# EAGLE design spoke-indus2 (EAGLE 5.10)
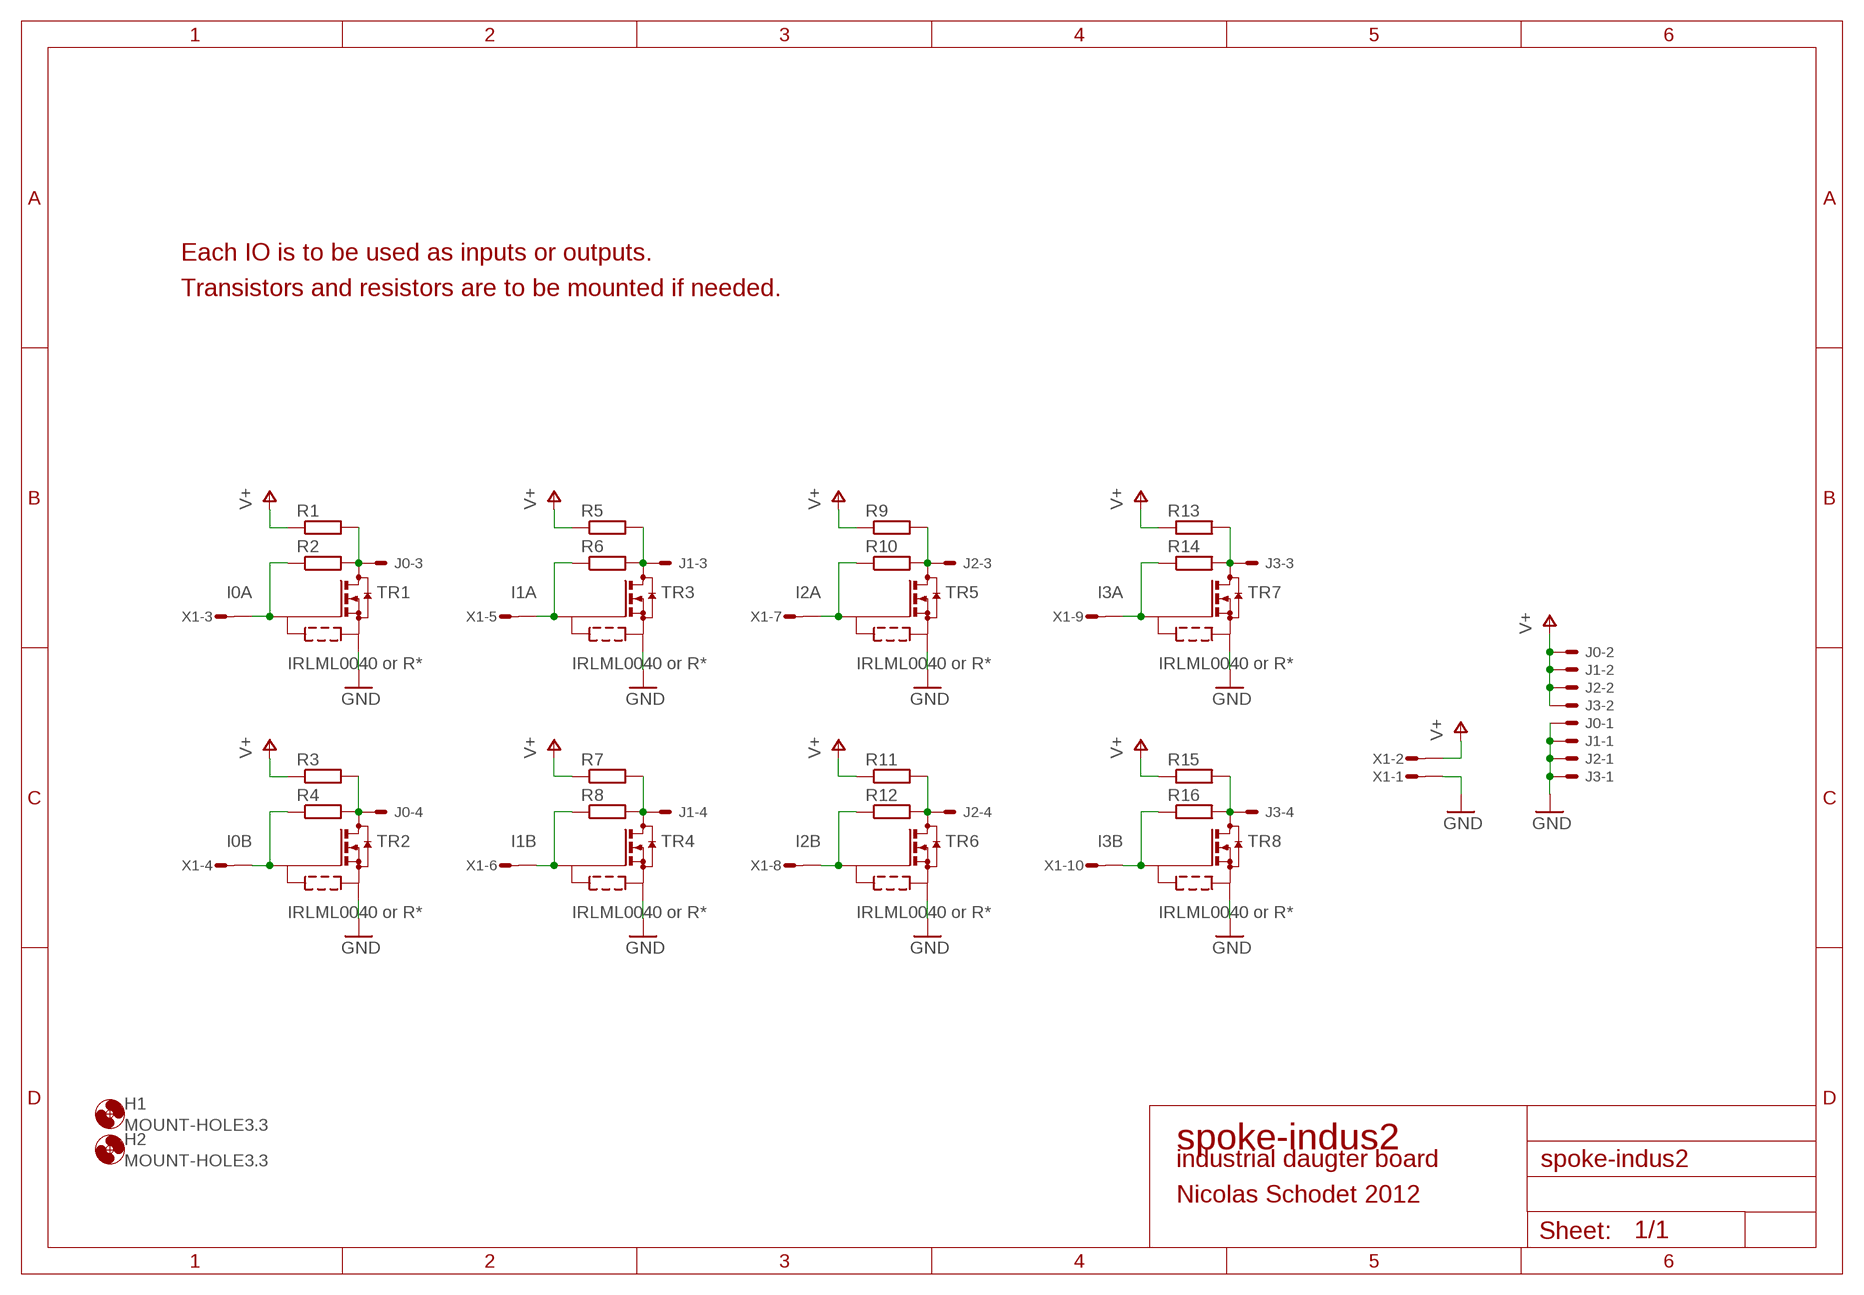
[diagram p0: schematic, sheet 1]

## Parts
H1  MOUNT-HOLE3.3  [3,3]
H2  MOUNT-HOLE3.3  [3,3]
J0  ED1X04  [ED1X04]
J1  ED1X04  [ED1X04]
J2  ED1X04  [ED1X04]
J3  ED1X04  [ED1X04]
R1  R-EU_R0603  [R0603]
R2  R-EU_R0603  [R0603]
R3  R-EU_R0603  [R0603]
R4  R-EU_R0603  [R0603]
R5  R-EU_R0603  [R0603]
R6  R-EU_R0603  [R0603]
R7  R-EU_R0603  [R0603]
R8  R-EU_R0603  [R0603]
R9  R-EU_R0603  [R0603]
R10  R-EU_R0603  [R0603]
R11  R-EU_R0603  [R0603]
R12  R-EU_R0603  [R0603]
R13  R-EU_R0603  [R0603]
R14  R-EU_R0603  [R0603]
R15  R-EU_R0603  [R0603]
R16  R-EU_R0603  [R0603]
TR1  IRLML0040 or R*  N-MOS_R  [SOT23_R0603]
TR2  IRLML0040 or R*  N-MOS_R  [SOT23_R0603]
TR3  IRLML0040 or R*  N-MOS_R  [SOT23_R0603]
TR4  IRLML0040 or R*  N-MOS_R  [SOT23_R0603]
TR5  IRLML0040 or R*  N-MOS_R  [SOT23_R0603]
TR6  IRLML0040 or R*  N-MOS_R  [SOT23_R0603]
TR7  IRLML0040 or R*  N-MOS_R  [SOT23_R0603]
TR8  IRLML0040 or R*  N-MOS_R  [SOT23_R0603]
X1  MICROMATCH-10  [MICROMATCH-10]

## Nets
GND [supply]: J0.1 J1.1 J2.1 J3.1 TR1.2(S) TR2.2(S) TR3.2(S) TR4.2(S) TR5.2(S) TR6.2(S) TR7.2(S) TR8.2(S) X1.1
I0A: R2.1 TR1.1(G) X1.3
I0AJ: J0.3 R1.2 R2.2 TR1.3(D)
I0B: R4.1 TR2.1(G) X1.4
I0BJ: J0.4 R3.2 R4.2 TR2.3(D)
I1A: R6.1 TR3.1(G) X1.5
I1AJ: J1.3 R5.2 R6.2 TR3.3(D)
I1B: R8.1 TR4.1(G) X1.6
I1BJ: J1.4 R7.2 R8.2 TR4.3(D)
I2A: R10.1 TR5.1(G) X1.7
I2AJ: J2.3 R9.2 R10.2 TR5.3(D)
I2B: R12.1 TR6.1(G) X1.8
I2BJ: J2.4 R11.2 R12.2 TR6.3(D)
I3A: R14.1 TR7.1(G) X1.9
I3AJ: J3.3 R13.2 R14.2 TR7.3(D)
I3B: R16.1 TR8.1(G) X1.10
I3BJ: J3.4 R15.2 R16.2 TR8.3(D)
V+: J0.2 J1.2 J2.2 J3.2 R1.1 R3.1 R5.1 R7.1 R9.1 R11.1 R13.1 R15.1 X1.2

## Notes on the sheet
- Each IO is to be used as inputs or outputs.
- Transistors and resistors are to be mounted if needed.
- spoke-indus2
- industrial daugter board
- Nicolas Schodet 2012

## Library data of the parts
H1 H2 = holes:MOUNT-HOLE: MOUNTING HOLE with drill center marker
J0 J1-J3 = apbteam_con-amp-he14:E?1X04: Male header simple row, 4 positions
R1-R16 = apbteam_rcl:R-EU_: RESISTOR, European symbol
TR1-TR8 = apbteam_transistor-small-signal:N-MOS_R: N-CHANNEL MOS FET or Resistor Only one can be mounted.
X1 = apbteam_con-amp-micromatch:MICROMATCH-10: MicroMaTch 10

## Net classes
1 supply: width 0.254 mm

## Board
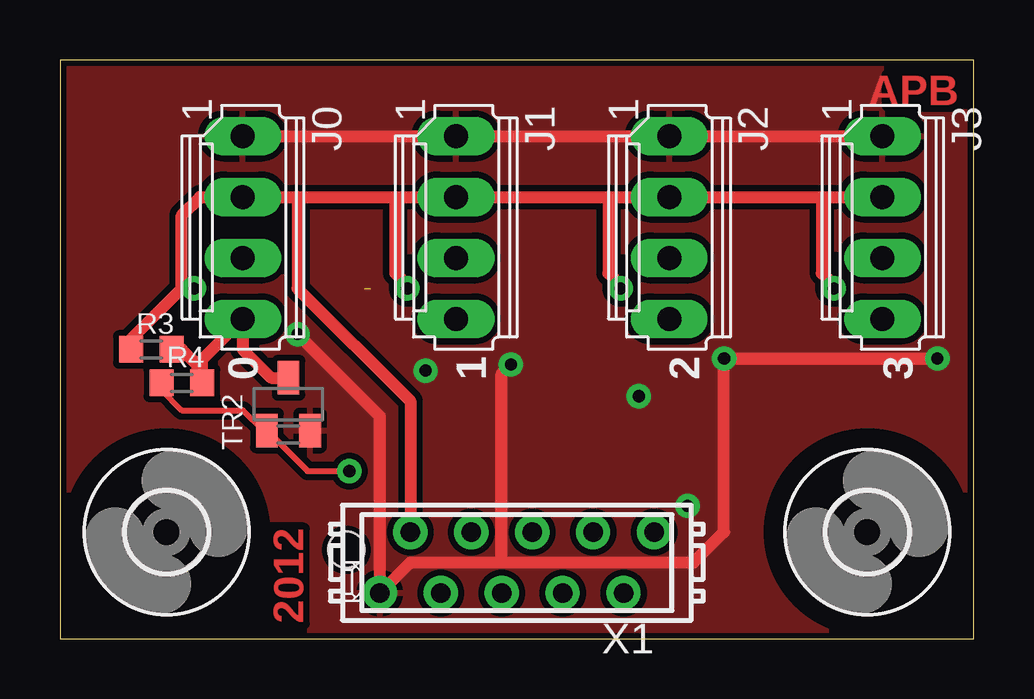
[diagram p1: board, top side]
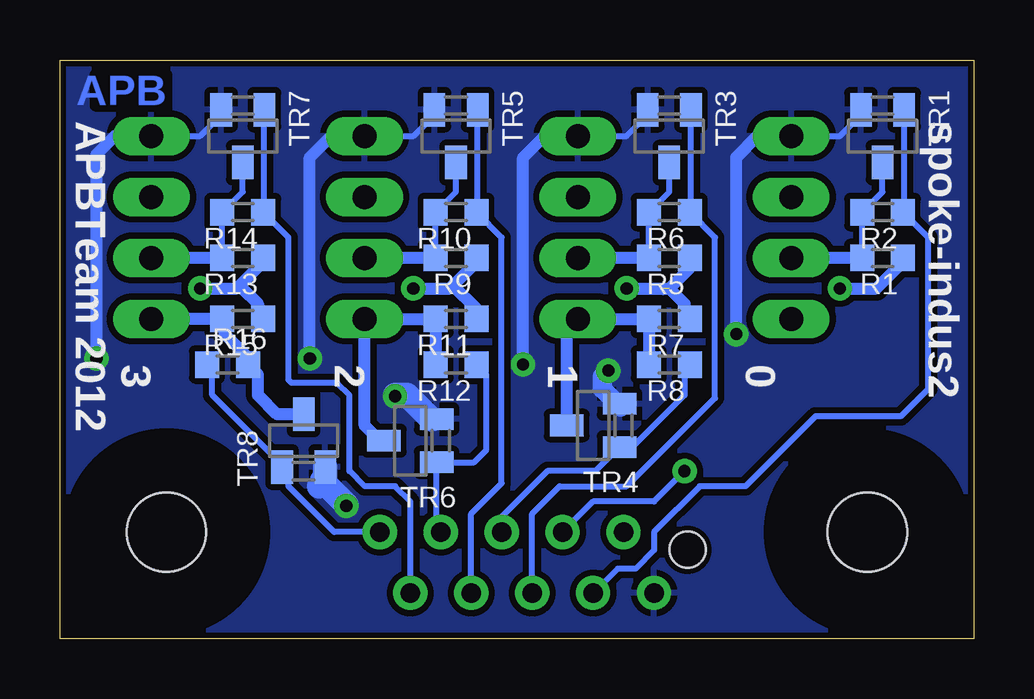
[diagram p2: board, bottom side, seen from below]

Size 38.1 x 24.13 mm. Coordinates in mm from the lower left corner, seen from the top.
Outline: 0,0 38.1,0 38.1,24.13 0,24.13 0,0
Copper layers (1*16): Top 0.035mm / dielectric 1.5mm / Bottom 0.035mm
Design rules "SparkFun": minimum track width 8mil, minimum drill 20mil, track to track 8mil, track to pad 8mil, pad to pad 8mil, via to via 8mil, smd to smd 8mil, copper to edge 10mil, drill to drill 8mil, minimum pad ring 12mil, minimum via ring 10mil, stop-mask expansion 4mil, vias tented up to drill 25mil, thermal gap 10mil

### Footprints (pad centres in the part's own frame; a part is rotated, then mirrored left to right if it is on the bottom)
3,3 = hole 3.3: 0,0
ED1X04 = drill 1 long: 1 -3.81,0; 2 -1.27,0; 3 1.27,0; 4 3.81,0
R0603 = smd 1 x 1.1: 1 -0.85,0; 2 0.85,0
SOT23_R0603 = smd 0.9 x 1.4: 1 -0.9,-1.1; 2 0.9,-1.1; 3 0,1.1
MICROMATCH-10 = drill 0.813 round: 1 5.715,1.27; 2 4.445,-1.27; 3 3.175,1.27; 4 1.905,-1.27; 5 0.635,1.27; 6 -0.635,-1.27; 7 -1.905,1.27; 8 -3.175,-1.27; 9 -4.445,1.27; 10 -5.715,-1.27 | hole 1.5: 7.11,-0.53

### Placement (x,y rotation side)
H1  4.45,4.45 0 top
H2  33.66,4.45 0 top
J0  7.62,17.14 270 top
J1  16.51,17.14 270 top
J2  25.4,17.14 270 top
J3  34.29,17.14 270 top
R1  3.81,15.88 180 bottom
R2  3.81,17.78 180 bottom
R3  3.81,12.06 0 top
R4  5.08,10.67 0 top
R5  12.7,15.88 180 bottom
R6  12.7,17.78 180 bottom
R7  12.7,13.34 180 bottom
R8  12.7,11.43 180 bottom
R9  21.59,15.88 180 bottom
R10  21.59,17.78 180 bottom
R11  21.59,13.34 180 bottom
R12  21.59,11.43 180 bottom
R13  30.48,15.88 180 bottom
R14  30.48,17.78 180 bottom
R15  30.48,13.34 180 bottom
R16  31.11,11.43 0 bottom
TR1  3.81,20.95 180 bottom
TR2  9.53,9.78 0 top
TR3  12.7,20.95 180 bottom
TR4  15.88,8.89 90 bottom
TR5  21.59,20.95 180 bottom
TR6  23.5,8.26 90 bottom
TR7  30.48,20.95 180 bottom
TR8  27.94,8.26 0 bottom
X1  19.05,3.17 180 top

### Tracks (layer width: path | path; a pad name or v marks a point on that pad's centre or on a via)
GND  (via drill 0.51)
  Top 0.508: J0.1 J1.1 J2.1 J3.1 | v9.91,12.7 13.34,9.27 X1.1 14.61,3.17 18.41,3.17 | 18.41,3.17 18.41,11.05 v18.8,11.43 | 18.41,3.17 26.42,3.17 27.69,4.45 v27.69,11.68 v36.58,11.68
  Bottom 0.254: TR1.2 4.71,21.83 5.59,20.95 J0.1 | TR3.2 13.6,21.83 14.48,20.95 J1.1 | TR5.2 22.49,21.83 23.37,20.95 J2.1 | TR7.2 31.38,21.83 32.26,20.95 J3.1
  Bottom 0.508: J0.1 9.02,20.95 9.91,20.07 v9.91,12.7 | v18.8,11.43 18.8,20.07 17.91,20.95 J1.1 | v27.69,11.68 27.69,20.07 26.8,20.95 J2.1 | v36.58,11.68 36.58,20.19 35.81,20.95 J3.1
  Bottom 0.813: v15.24,11.18 15.49,10.92 15.49,10.41 14.73,9.65
  Bottom 1.016: 24.13,10.16 23.62,10.16 22.61,9.14 | 27.18,6.6 26.16,5.59 | TR8.2 27.04,6.62 27.3,6.35
  other vias: 24.13,10.11 26.16,5.54
  pour Top (isolate 0.254): 0,24.13 38.1,24.13 38.1,0 0,0
  pour Bottom (isolate 0.254): 0,24.13 38.1,24.13 38.1,0 0,0
I0A
  Bottom 0.254: TR1.1 2.91,17.83 R2.1 1.91,16.73 1.91,10.41 3.05,9.27 6.6,9.27 9.53,6.35 11.43,6.35 13.34,4.45 13.34,3.68 14.1,2.92 14.86,2.92 X1.3
I0AJ
  Bottom 0.254: TR1.3 3.81,18.63 R2.2 R1.2
  Bottom 0.508: R1.2 J0.3
I0B  (via drill 0.51)
  Top 0.254: v12.06,6.99 10.32,6.99 TR2.1 8.47,8.68 7.62,9.53 5.08,9.53 4.23,10.38 R4.1
  Bottom 0.254: X1.4 15.88,5.71 13.34,5.71 v12.06,6.99
I0BJ
  Top 0.508: TR2.3 8.81,10.88 7.62,12.06 J0.4 5.93,11.64 R4.2 5.71,10.88 5.71,11.43 5.08,12.06 R3.2
I1A
  Bottom 0.254: TR3.1 11.8,17.83 R6.1 10.79,16.73 10.79,10.03 14.48,6.35 17.27,6.35 18.41,5.21 X1.5
I1AJ
  Bottom 0.254: TR3.3 12.7,18.63 R6.2 R5.2
  Bottom 0.508: R5.2 J1.3
I1B
  Bottom 0.254: R8.1 12.06,11.21 12.06,10.16 14.23,7.99 TR4.1 15.78,6.99 17.78,6.99 19.68,5.08 X1.6
I1BJ
  Bottom 0.508: TR4.3 16.98,12.87 J1.4 R7.2 R8.2
I2A
  Bottom 0.254: TR5.1 20.69,17.83 R10.1 19.68,16.73 19.68,6.48 20.95,5.21 X1.7
I2AJ
  Bottom 0.254: TR5.3 21.59,18.63 R10.2 R9.2
  Bottom 0.508: R9.2 J2.3
I2B
  Bottom 0.254: 20.95,11.21 R12.1 20.32,11.01 20.32,7.87 20.84,7.36 TR6.1 22.39,4.62 X1.8
I2BJ
  Bottom 0.508: R12.2 R11.2 J2.4 25.4,8.89 24.77,8.26 TR6.3
I3A
  Bottom 0.254: TR7.1 29.58,17.83 R14.1 28.57,16.73 28.57,10.79 28.45,10.67 26.54,10.67 26.04,10.16 26.04,6.99 25.4,6.35 24.13,6.35 23.5,5.71 X1.9
I3AJ
  Bottom 0.254: TR7.3 30.48,18.63 R14.2 R13.2
  Bottom 0.508: R13.2 J3.3
I3B
  Bottom 0.254: X1.10 26.67,4.45 28.57,6.35 28.57,6.89 TR8.1 28.84,7.25 31.75,10.16 31.75,11.21 R16.1
I3BJ
  Bottom 0.254: R16.2 30.27,11.72 | 31.24,13.25 R15.2
  Bottom 0.508: R15.2 J3.4 | TR8.3 29.04,9.36 29.84,10.16 29.84,11.01 R16.2 | 30.27,11.72 31.24,12.7 31.24,13.25
V+  (via drill 0.51)  (1 unrouted)
  Top 0.508: 31.75,18.41 J2.2 22.86,18.41 | 31.75,18.41 J3.2 | 22.86,18.41 J1.2 13.97,18.41 | 9.91,18.41 J0.2 5.84,18.41 5.08,17.65 5.08,14.61 | 9.91,18.41 13.97,18.41 | X1.2 14.61,9.91 9.91,14.61 9.91,18.41 | v14.48,14.61 14.48,14.73 13.97,15.24 13.97,18.41 | v23.37,14.61 23.37,14.73 22.86,15.24 22.86,18.41 | v32.26,14.61 32.26,14.73 31.75,15.24 31.75,18.41 | 5.08,14.61 v5.59,14.61 | R3.1 2.96,12.48 5.08,14.61
  Bottom 0.254: 20.74,15.71 R9.1 | 21.84,14.61 21.72,14.73 | 29.63,15.71 R13.1 | 11.85,15.71 R5.1 | 2.96,15.71 R1.1 | 20.74,13.76 R11.1 | 30.73,14.61 30.48,14.61 | 29.84,13.55 R15.1 | 12.95,14.44 12.95,14.61
  Bottom 0.508: 20.74,15.71 21.72,14.73 20.74,13.76 | v23.37,14.61 21.84,14.61 | 29.63,15.71 30.73,14.61 v32.26,14.61 | 2.96,15.71 4.06,14.61 v5.59,14.61 | 30.48,14.61 29.84,13.97 29.84,13.55 | v14.48,14.61 12.7,14.61 | 12.7,14.61 12.06,13.97 12.06,13.55 R7.1 | 11.85,15.71 11.85,15.46 12.7,14.61

### Text on the board
Top: APB | 2012
Bottom: APB
tSilk: 0 | 1 | 2 | 3
bSilk: spoke-indus2 | APBTeam 2012 | 0 | 1 | 2 | 3